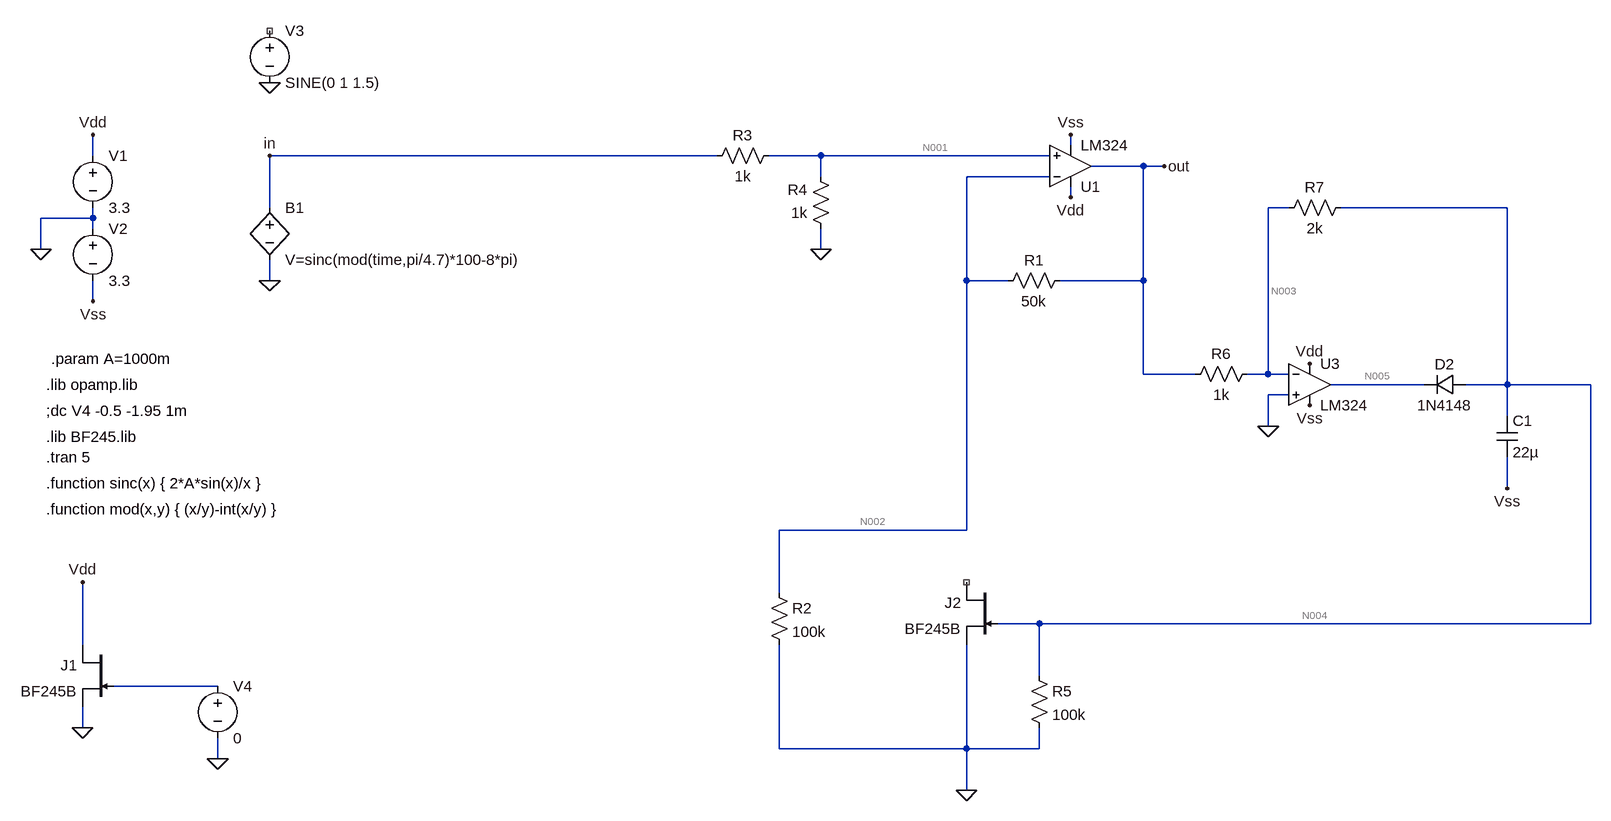
[diagram p0: schematic agc_4.asc]
agc_4.asc, the LTspice schematic file:
Version 4
SHEET 1 2408 940
WIRE 704 -176 704 -192
WIRE -800 -160 -800 -192
WIRE 160 -160 -528 -160
WIRE 320 -160 240 -160
WIRE 672 -160 320 -160
WIRE 816 -144 736 -144
WIRE 848 -144 816 -144
WIRE 320 -128 320 -160
WIRE 672 -128 544 -128
WIRE 704 -96 704 -112
WIRE -528 -80 -528 -160
WIRE 1040 -80 1008 -80
WIRE 1376 -80 1120 -80
WIRE -800 -64 -800 -80
WIRE -800 -64 -880 -64
WIRE -800 -48 -800 -64
WIRE -880 -16 -880 -64
WIRE 320 -16 320 -48
WIRE -528 32 -528 0
WIRE 544 32 544 -128
WIRE 608 32 544 32
WIRE 816 32 816 -144
WIRE 816 32 688 32
WIRE -800 64 -800 32
WIRE 816 176 816 32
WIRE 896 176 816 176
WIRE 1008 176 1008 -80
WIRE 1008 176 976 176
WIRE 1040 176 1008 176
WIRE 1248 192 1104 192
WIRE 1376 192 1376 -80
WIRE 1376 192 1312 192
WIRE 1504 192 1376 192
WIRE 1040 208 1008 208
WIRE 1376 240 1376 192
WIRE 1008 256 1008 208
WIRE 1376 352 1376 304
WIRE 544 416 544 32
WIRE 544 416 256 416
WIRE 256 512 256 416
WIRE 656 560 592 560
WIRE 1504 560 1504 192
WIRE 1504 560 656 560
WIRE -816 592 -816 496
WIRE 656 640 656 560
WIRE -608 656 -768 656
WIRE -816 720 -816 688
WIRE 256 752 256 592
WIRE 544 752 544 592
WIRE 544 752 256 752
WIRE 656 752 656 720
WIRE 656 752 544 752
WIRE -608 768 -608 736
WIRE 544 816 544 752
FLAG -880 -16 0
FLAG -800 -192 Vdd
FLAG 704 -96 Vdd
FLAG 704 -192 Vss
FLAG -800 64 Vss
FLAG -528 32 0
FLAG 848 -144 out
FLAG -528 -160 in
FLAG -816 720 0
FLAG -816 496 Vdd
FLAG -608 768 0
FLAG 1072 224 Vss
FLAG 1072 160 Vdd
FLAG 1376 352 Vss
FLAG 544 816 0
FLAG -528 -272 0
FLAG 320 -16 0
FLAG 1008 256 0
SYMBOL voltage -800 -176 R0
SYMATTR InstName V1
SYMATTR Value 3.3
SYMBOL voltage -800 -64 R0
SYMATTR InstName V2
SYMATTR Value 3.3
SYMBOL res 704 16 R90
WINDOW 0 0 56 VBottom 2
WINDOW 3 32 56 VTop 2
SYMATTR InstName R1
SYMATTR Value 50k
SYMBOL njf -768 592 M0
SYMATTR InstName J1
SYMATTR Value BF245B
SYMBOL voltage -608 640 R0
SYMATTR InstName V4
SYMATTR Value 0
SYMBOL Opamps\\opamp2 704 -80 M180
SYMATTR InstName U1
SYMATTR Value LM324
SYMBOL Opamps\\opamp2 1072 128 R0
SYMATTR InstName U3
SYMATTR Value LM324
SYMBOL diode 1312 176 R90
WINDOW 0 0 32 VBottom 2
WINDOW 3 32 32 VTop 2
SYMATTR InstName D2
SYMATTR Value 1N4148
SYMBOL cap 1360 240 R0
SYMATTR InstName C1
SYMATTR Value 22µ
SYMBOL njf 592 496 M0
SYMATTR InstName J2
SYMATTR Value BF245B
SYMBOL res 240 496 R0
SYMATTR InstName R2
SYMATTR Value 100k
SYMBOL res 640 624 R0
SYMATTR InstName R5
SYMATTR Value 100k
SYMBOL bv -528 -96 R0
SYMATTR InstName B1
SYMATTR Value V=sinc(mod(time,pi/4.7)*100-8*pi)
SYMBOL voltage -528 -368 R0
WINDOW 123 0 0 Left 2
WINDOW 39 0 0 Left 2
SYMATTR InstName V3
SYMATTR Value SINE(0 1 1.5)
SYMBOL res 256 -176 R90
WINDOW 0 0 56 VBottom 2
WINDOW 3 32 56 VTop 2
SYMATTR InstName R3
SYMATTR Value 1k
SYMBOL res 336 -32 R180
WINDOW 0 36 76 Left 2
WINDOW 3 36 40 Left 2
SYMATTR InstName R4
SYMATTR Value 1k
SYMBOL res 992 160 R90
WINDOW 0 0 56 VBottom 2
WINDOW 3 32 56 VTop 2
SYMATTR InstName R6
SYMATTR Value 1k
SYMBOL res 1136 -96 R90
WINDOW 0 0 56 VBottom 2
WINDOW 3 32 56 VTop 2
SYMATTR InstName R7
SYMATTR Value 2k
TEXT -872 232 Left 2 !;dc V4 -0.5 -1.95 1m
TEXT -872 192 Left 2 !.lib opamp.lib
TEXT -872 272 Left 2 !.lib BF245.lib
TEXT -872 304 Left 2 !.tran 5
TEXT -872 344 Left 2 !.function sinc(x) { 2*A*sin(x)/x }
TEXT -872 384 Left 2 !.function mod(x,y) { (x/y)-int(x/y) }
TEXT -864 152 Left 2 !.param A=1000m

The netlist it stands for:
* agc_4.asc
V1 Vdd 0 3.3
V2 0 Vss 3.3
R1 out N002 50k
J1 Vdd N006 0 BF245B
V4 N006 0 0
XU1 N001 N002 Vdd Vss out LM324  ; pins In+ In- V+ V- OUT
XU3 0 N003 Vdd Vss N005 LM324  ; pins In+ In- V+ V- OUT
D2 N004 N005 1N4148
C1 N004 Vss 22µ
J2 NC_01 N004 0 BF245B
R2 N002 0 100k
R5 N004 0 100k
B1 in 0 V=sinc(mod(time,pi/4.7)*100-8*pi)
V3 NC_02 0 SINE(0 1 1.5)
R3 N001 in 1k
R4 0 N001 1k
R6 N003 out 1k
R7 N004 N003 2k
.model D D
.lib standard.dio
.model NJF NJF
.model PJF PJF
.lib standard.jft
;dc V4 -0.5 -1.95 1m
.lib opamp.lib
.lib BF245.lib
.tran 5
.function sinc(x) { 2*A*sin(x)/x }
.function mod(x,y) { (x/y)-int(x/y) }
.param A=1000m
.backanno
.end

* Results of the author's LTspice run, read from the files saved beside the schematic
* Operating Point, zero values left out:
*   V(vdd) = 3.3 V
*   V(vss) = -3.3 V
*   V(out) = -2.503 mV
*   V(n002) = -170.1 µV
*   V(n001) = 22.37 µV
*   V(n005) = 2.577 V
*   V(n003) = -2.431 mV
*   V(n004) = -2.378 mV
*   I(B1) = 22.37 nA
*   I(D2) = -2.523 nA
*   Id(J1) = 5.994 mA
*   Ig(J1) = -3.3 pA
*   Is(J1) = -5.994 mA
*   I(R7) = 26.3 nA
*   I(R6) = 72.53 nA
*   I(R4) = -22.37 nA
*   I(R3) = 22.37 nA
*   I(R5) = -23.78 nA
*   I(R2) = -1.701 nA
*   I(R1) = -46.66 nA
*   I(V4) = 3.3 pA
*   I(V2) = -1.484 mA
*   I(V1) = -7.478 mA
*   Ix(u1:1) = -44.74 nA
*   Ix(u1:2) = -44.96 nA
*   Ix(u1:3) = 742.3 µA
*   Ix(u1:4) = -742.3 µA
*   Ix(u1:5) = 119.2 nA
*   Ix(u3:1) = -43.48 nA
*   Ix(u3:2) = -46.22 nA
*   Ix(u3:3) = 742.1 µA
*   Ix(u3:4) = -742 µA
*   Ix(u3:5) = -2.522 nA